# EAGLE design bbb_arduino (EAGLE 6.4)
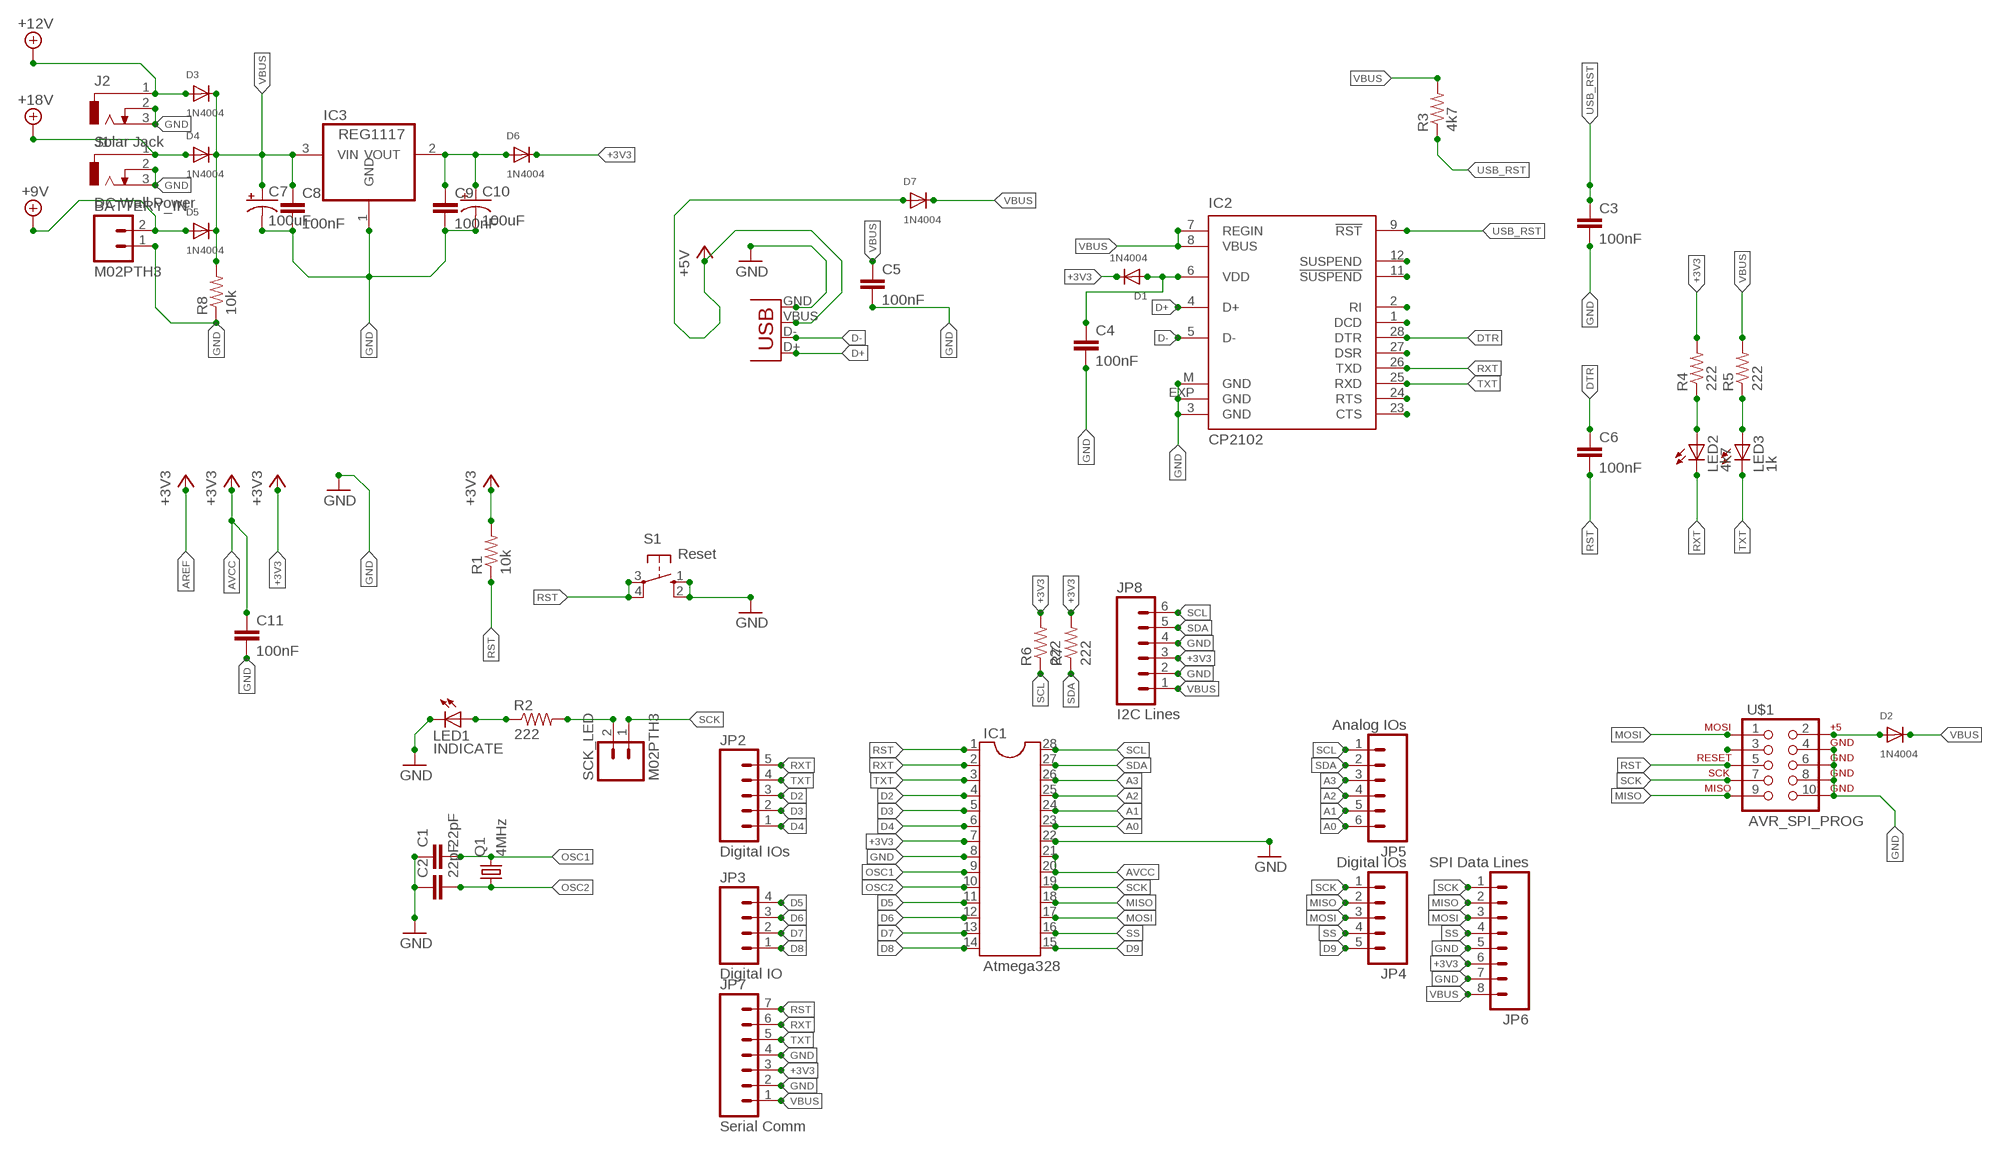
[diagram p0: schematic, sheet 1]

## Parts
BATTERY_IN  M02PTH3  [1X02_LONGPADS]
C1  22pF  CAP1206  [1206]
C2  22pF  CAP1206  [1206]
C3  100nF  CAP1206  [1206]
C4  100nF  CAP1206  [1206]
C5  100nF  CAP1206  [1206]
C6  100nF  CAP1206  [1206]
C7  100uF  CAP_POLPTH1  [CPOL-RADIAL-100UF-25V]
C8  100nF  CAP1206  [1206]
C9  100nF  CAP1206  [1206]
C10  100uF  CAP_POLPTH1  [CPOL-RADIAL-100UF-25V]
C11  100nF  CAP1206  [1206]
D1  1N4004  DIODESMA  [SMADIODE]
D2  1N4004  DIODESMA  [SMADIODE]
D3  1N4004  DIODESMA  [SMADIODE]
D4  1N4004  DIODESMA  [SMADIODE]
D5  1N4004  DIODESMA  [SMADIODE]
D6  1N4004  DIODESMA  [SMADIODE]
D7  1N4004  DIODESMA  [SMADIODE]
IC1  Atmega328  DIL28-3  [DIL28-3]
IC2  CP2102  [MLP28]
IC3  REG1117  [SOT223]
J1  DC Wall Power  DCJ0303  [DCJ0303]
J2  Solar Jack  DCJ0303  [DCJ0303]
JP1  USB-SMD-NS  [USB-MINIB-NOSTOP]
JP2  Digital IOs  M05PTH_LONGPADS  [1X05_LONGPADS]
JP3  Digital IO  M04LONGPADS  [1X04_LONGPADS]
JP4  Digital IOs  M05PTH_LONGPADS  [1X05_LONGPADS]
JP5  Analog IOs  M06LONGPADS  [1X06_LONGPADS]
JP6  SPI Data Lines  M08LONGPADS  [1X08_LONGPADS]
JP7  Serial Comm  M07LONGPADS  [1X07_LONGPADS]
JP8  I2C Lines  M06LONGPADS  [1X06_LONGPADS]
LED1  INDICATE  LEDCHIPLED_1206  [CHIPLED_1206]
LED2  4k7  LEDCHIPLED_1206  [CHIPLED_1206]
LED3  1k  LEDCHIPLED_1206  [CHIPLED_1206]
Q1  4MHz  CRYSTALHC49S  [HC49/S]
R1  10k  RESISTOR1206  [1206]
R2  222  RESISTOR1206  [1206]
R3  4k7  RESISTOR1206  [1206]
R4  222  RESISTOR1206  [1206]
R5  222  RESISTOR1206  [1206]
R6  222  RESISTOR1206  [1206]
R7  222  RESISTOR1206  [1206]
R8  10k  RESISTOR1206  [1206]
S1  Reset  10-XX  [B3F-10XX]
SCK_LED  M02PTH3  [1X02_LONGPADS]
U$1  AVR_SPI_PROG  [AVR_ICSP]

## Nets
+3V3: D1.C D6.C IC1.7 JP6.6 JP7.3 JP8.3 R1.2 R4.2 R6.2 R7.2
+5V: D7.A JP1.VBUS
+9V: BATTERY_IN.2 D5.A
+12V: D3.A J2.1
+18V: D4.A J1.1
A0: IC1.23 JP5.6
A1: IC1.24 JP5.5
A2: IC1.25 JP5.4
A3: IC1.26 JP5.3
AVCC: C11.1 IC1.20 IC1.21 ; supply symbol labelled +3V3
D2: IC1.4 JP2.3
D3: IC1.5 JP2.2
D4: IC1.6 JP2.1
D5: IC1.11 JP3.4
D6: IC1.12 JP3.3
D7: IC1.13 JP3.2
D8: IC1.14 JP3.1
D9: IC1.15 JP4.5
D+: IC2.4(D+) JP1.D+
D-: IC2.5(D-) JP1.D-
DTR: C6.1 IC2.28(DTR)
GND: BATTERY_IN.1 C1.1 C2.1 C3.2 C4.2 C5.2 C7.2(-) C8.2 C9.2 C10.2(-) C11.2 IC1.8 IC1.22 IC2.3(GND) IC2.EXP(GND) IC2.M(GND) IC3.1(GND) J1.2 J1.3 J2.2 J2.3 JP1.GND JP6.5 JP6.7 JP7.2 JP7.4 JP8.2 JP8.4 LED1.C R8.1 S1.1(S) S1.2(S1) U$1.4 U$1.6 U$1.8 U$1.10
MISO: IC1.18 JP4.2 JP6.2 U$1.9
MOSI: IC1.17 JP4.3 JP6.3 U$1.1
N$2: LED1.A R2.1
N$3: U$1.3
N$4: R2.2 SCK_LED.2
N$5: LED2.A R4.1
N$6: C4.1 D1.A IC2.6(VDD)
N$7: LED3.A R5.1
N$15: D2.A U$1.2
N$16: IC2.12(SUSPEND)
N$17: IC2.11(!SUSPEND)
N$18: IC2.2(RI)
N$19: IC2.1(DCD)
N$21: IC2.27(DSR)
N$24: IC2.24(RTS)
N$25: IC2.23(CTS)
N$33: C9.1 C10.1(+) D6.A IC3.2(VOUT)
OSC1: C1.2 IC1.9 Q1.2
OSC2: C2.2 IC1.10 Q1.1
RST: C6.2 IC1.1 JP7.7 R1.1 S1.3(P) S1.4(P1) U$1.5
RXT: IC1.2 IC2.26(TXD) JP2.5 JP7.6 LED2.C
SCK: IC1.19 JP4.1 JP6.1 SCK_LED.1 U$1.7
SCL: IC1.28 JP5.1 JP8.6 R6.1
SDA: IC1.27 JP5.2 JP8.5 R7.1
SS: IC1.16 JP4.4 JP6.4
TXT: IC1.3 IC2.25(RXD) JP2.4 JP7.5 LED3.C
USB_RST: C3.1 IC2.9(!RST) R3.1
VBUS: C5.1 C7.1(+) C8.1 D2.C D3.C D4.C D5.C D7.C IC2.7(REGIN) IC2.8(VBUS) IC3.3(VIN) JP6.8 JP7.1 JP8.1 R3.2 R5.2 R8.2

## Library data of the parts
BATTERY_IN SCK_LED = SparkFun-Connectors:M02: Standard 2-pin 0.1" header. Use with - straight break away headers ( PRT-00116) - right angle break away headers (PRT-00553) - swiss pins (PRT-00743) - machine pins (PRT-00117) - female headers (PRT-00115) Molex polarized connector foot print use with: PRT-08233 with associated crimp pins and housings. 2.54_SCREWTERM for use with PRT-10571. 3.5mm Screw Terminal footprints for PRT-08084 5mm Screw Terminal footprints for use with PRT-08433
C1-C6 C8 C9 C11 = SparkFun-Capacitors:CAP: Capacitor Standard 0603 ceramic capacitor, and 0.1" leaded capacitor.
C7 C10 = SparkFun-Capacitors:CAP_POL: Capacitor Polarized These are standard SMD and PTH capacitors. Normally 10uF, 47uF, and 100uF in electrolytic and tantalum varieties. Always verify the external diameter of the through hole cap, it varies with capacity, voltage, and manufacturer. The EIA devices should be standard.
D1-D7 = adafruit:DIODE: Diode SMADIODE - SMA Surface Mount Package 20V 1A Schottky Diode Digikey: 641-1014-6-ND DO-1N4148 - Through Hole Small Current Diode SOD-123 20V 1 A (.5mV Vf) Schottky Diode - Digikey: MBRX120TPMSCT-ND SOD-323 10V 570mA (.38mV Vf, 3ns) Schottky Diode - Digikey: ZLLS410CT-ND SOD-523 30V 30mA Schottky Diode (RB751S-40TE61) - Digikey: RB751S-40TE61CT-ND SOT23-R/W - SOT23 Package (R = Solder Paste/Reflow Ovens, W = Hand-Soldering) BAT54Film 40V 300mA - Digikey: 497-7162-1-ND
IC1 = ic-package:DIL28: Dual In Line
IC2 = silabs:CP210*: Single-Chip USB to UART Bridge Source: www.silabs.com .. CP2101.pdf / cp2102.pdf; MF: FARNELL; MPN: CP2102-GM; OC_FARNELL: 9282130; OC_NEWARK: 30K5635
IC3 = burr-brown:REG1117: 800mA and 1A Low Dropout (LDO) Positive Regulator 1.8V, 2.5V, 2.85V, 3.3V, 5V, and Adj; MPN: REG1117; OC_FARNELL: 1097566; OC_NEWARK: 14P6981
J1 J2 = con-jack:DCJ0303: DC POWER JACK Source: DCJ0303.pdf; OC_FARNELL: unknown; OC_NEWARK: unknown
JP1 = SparkFun-Connectors:USB: USB Connectors USB-B-PTH is fully proven SKU : PRT-00139/CONN-08278 USB-miniB is fully proven SKU : PRT-00587 USB-A-PCB is untested. USB-A-H is throughly reviewed, but untested. Spark Fun Electronics SKU : PRT-00437 USB-B-SMT is throughly reviewed, but untested. Needs silkscreen touching up. USB-A-S has not been used/tested USB-MB-H has not been used/tested USB-MICROB has been used. CONN-09505
JP2 JP4 = SparkFun-Connectors:M05: Header 5 Standard 5-pin 0.1" header. Use with straight break away headers (SKU : PRT-00116), right angle break away headers (PRT-00553), swiss pins (PRT-00743), machine pins (PRT-00117), and female headers (PRT-00115). Molex polarized connector foot print use with SKU : PRT-08230 with associated crimp pins and housings.
JP3 = SparkFun-Connectors:M04: Header 4 Standard 4-pin 0.1" header. Use with straight break away headers (SKU : PRT-00116), right angle break away headers (PRT-00553), swiss pins (PRT-00743), machine pins (PRT-00117), and female headers (PRT-00115). Molex polarized connector foot print use with SKU : PRT-08231 with associated crimp pins and housings. 1MM SMD Version SKU: PRT-10208
JP5 JP8 = SparkFun-Connectors:M06: Header 6 Standard 6-pin 0.1" header. Use with straight break away headers (SKU : PRT-00116), right angle break away headers (PRT-00553), swiss pins (PRT-00743), machine pins (PRT-00117), and female headers (PRT-00115). Molex polarized connector foot print use with SKU : PRT-08094 with associated crimp pins and housings. NOTES ON THE VARIANTS LOCK and LOCK_LONGPADS... This footprint was designed to help hold the alignment of a through-hole component (i.e. 6-pin header) while soldering it into place. You may notice that each hole has been shifted either up or down by 0.005 of an inch from it's more standard position (which is a perfectly straight line). This slight alteration caused the pins (the squares in the middle) to touch the edges of the holes. Because they are alternating, it causes a "brace" to hold the component in place. 0.005 has proven to be the perfect amount of "off-center" position when using our standard breakaway headers. Although looks a little odd when you look at the bare footprint, once you have a header in there, the alteration is very hard to notice. Also,if you push a header all the way into place, it is covered up entirely on the bottom side. This idea of altering the position of holes to aid alignment will be further integrated into the Sparkfun Library for other footprints. It can help hold any component with 3 or more connection pins.
JP6 = SparkFun-Connectors:M08: Header 8 Standard 8-pin 0.1" header. Use with straight break away headers (SKU : PRT-00116), right angle break away headers (PRT-00553), swiss pins (PRT-00743), machine pins (PRT-00117), and female headers (PRT-00115).
JP7 = SparkFun-Connectors:M07: Header 7 Standard 7-pin 0.1" header. Use with straight break away headers (SKU : PRT-00116), right angle break away headers (PRT-00553), swiss pins (PRT-00743), machine pins (PRT-00117), and female headers (PRT-00115). NOTES ON THE VARIANTS LOCK and LOCK_LONGPADS... This footprint was designed to help hold the alignment of a through-hole component (i.e. 7-pin header) while soldering it into place. You may notice that each hole has been shifted either up or down by 0.005 of an inch from it's more standard position (which is usually a perfectly straight line). This slight alteration caused the pins (the squares in the middle) to touch the edges of the holes. Because they are alternating, it causes a "brace" to hold the header in place. 0.005 has proven to be the perfect amount of "off-center" position when using our standard breakaway headers. Although looks a little odd when you look at the bare footprint, once you have a header in there, the alteration is very hard to notice. Also, if you push a header all the way into place, it is covered up entirely on the bottom side. This idea of altering the position of holes to aid alignment will be further integrated into the Sparkfun Library for other footprints. It can help hold any component with 3 or more connection pins.
LED1-LED3 = adafruit:LED: LED OSRAM: - CHIPLED LG R971, LG N971, LY N971, LG Q971, LY Q971, LO R971, LY R971 LH N974, LH R974 LS Q976, LO Q976, LY Q976 LO Q996 - Hyper CHIPLED LW Q18S LB Q993, LB Q99A, LB R99A - SideLED LS A670, LO A670, LY A670, LG A670, LP A670 LB A673, LV A673, LT A673, LW A673 LH A674 LY A675 LS A676, LA A676, LO A676, LY A676, LW A676 LS A679, LY A679, LG A679 - Hyper Micro SIDELED® LS Y876, LA Y876, LO Y876, LY Y876 LT Y87S - SmartLED LW L88C, LW L88S LB L89C, LB L89S, LG L890 LS L89K, LO L89K, LY L89K LS L896, LA L896, LO L896, LY L896 - TOPLED LS T670, LO T670, LY T670, LG T670, LP T670 LSG T670, LSP T670, LSY T670, LOP T670, LYG T670 LG T671, LOG T671, LSG T671 LB T673, LV T673, LT T673, LW T673 LH T674 LS T676, LA T676, LO T676, LY T676, LB T676, LH T676, LSB T676, LW T676 LB T67C, LV T67C, LT T67C, LS T67K, LO T67K, LY T67K, LW E67C LS E67B, LA E67B, LO E67B, LY E67B, LB E67C, LV E67C, LT E67C LW T67C LS T679, LY T679, LG T679 LS T770, LO T770, LY T770, LG T770, LP T770 LB T773, LV T773, LT T773, LW T773 LH T774 LS E675, LA E675, LY E675, LS T675 LS T776, LA T776, LO T776, LY T776, LB T776 LHGB T686 LT T68C, LB T68C - Hyper Mini TOPLED® LB M676 - Mini TOPLED Santana® LG M470 LS M47K, LO M47K, LY M47K Source: http://www.osram.convergy.de/
Q1 = adafruit:CRYSTAL: CRYSTAL; OC_FARNELL: 1667008; OC_NEWARK: unknown
R1-R8 = SparkFun-Resistors:RESISTOR: Resistor Basic schematic elements and footprints for 0603, 1206, and PTH resistors.
S1 = switch-omron:10-XX: OMRON SWITCH; MPN: B3F-1000; OC_FARNELL: 176432; OC_NEWARK: 36M3542
U$1 = SparkFun-Connectors:AVR_SPI_PROG: AVR 10-pin ICSP Header This is the standard AVR In Circuit Serial Programming header. Minimal, but includes pin one indicator. Works with standard Olimex programmers. Also look for the 6-pin reduced version. Spark Fun Electronics SKU: PRT-00778

## Board
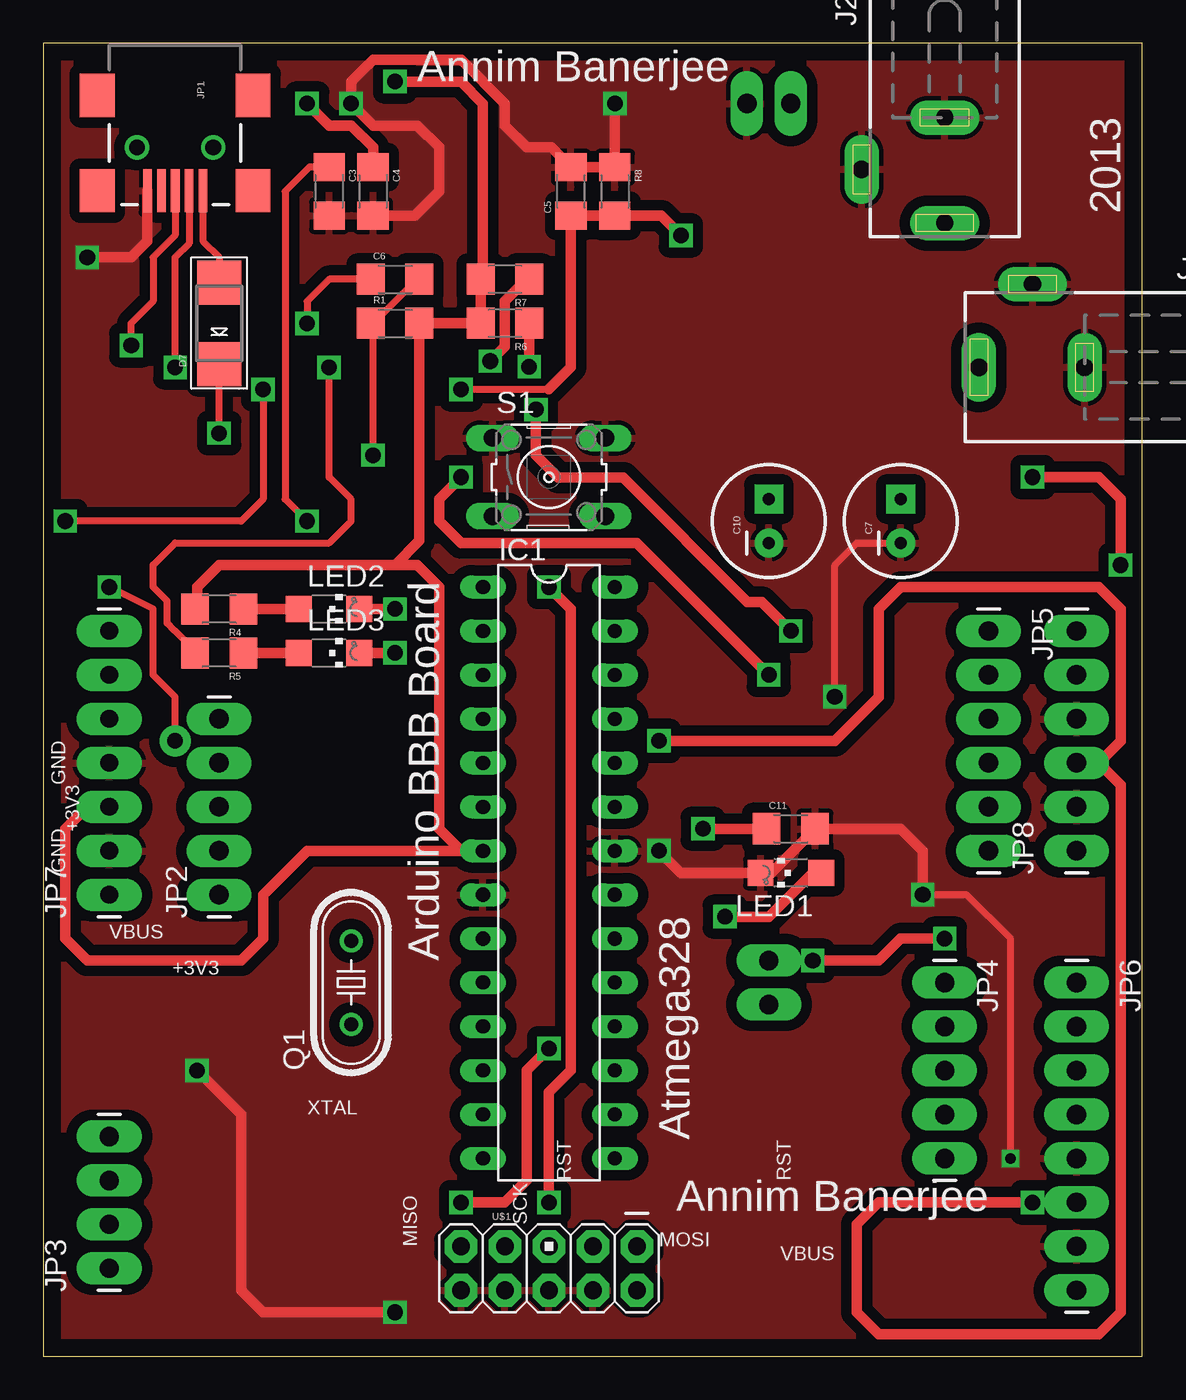
[diagram p1: board, top side]
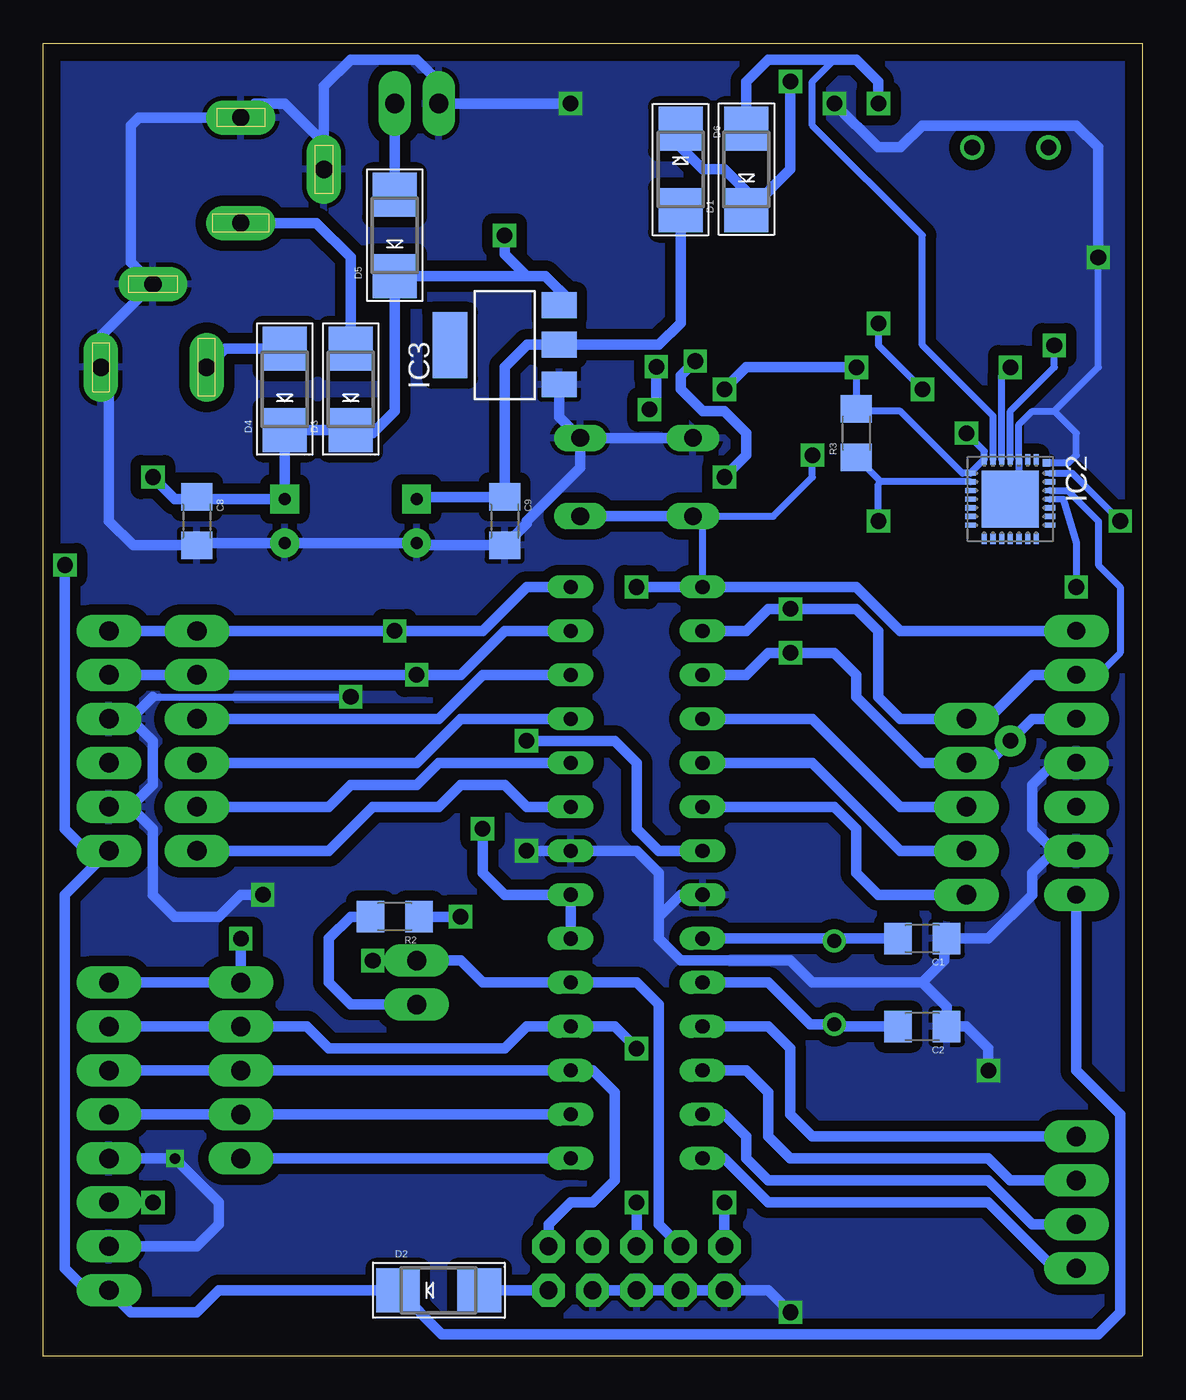
[diagram p2: board, bottom side, seen from below]

Size 63.48 x 75.87 mm. Coordinates in mm from the lower left corner, seen from the top.
Outline: 0,0 63.48,0 63.48,75.87 0,75.87 0,0
Copper layers (1*16): Top 0.035mm / dielectric 1.5mm / Bottom 0.035mm
Design rules "default": minimum track width 10mil, minimum drill 24mil, track to track 8mil, track to pad 8mil, pad to pad 8mil, via to via 8mil, smd to smd 8mil, copper to edge 40mil, drill to drill 8mil, minimum pad ring 10mil, minimum via ring 8mil, stop-mask expansion 4mil, vias tented up to drill 0mil, thermal gap 10mil

### Footprints (pad centres in the part's own frame; a part is rotated, then mirrored left to right if it is on the bottom)
1X02_LONGPADS = drill 1.118 pad 1.88 long: 1 0,0; 2 2.54,0
1206 = smd 1.6 x 1.8: 1 -1.4,0; 2 1.4,0
CPOL-RADIAL-100UF-25V = drill 0.7 pad 1.651 square: 1 1.27,0 | drill 0.7 pad 1.651: 2 -1.27,0
SMADIODE = smd 2.54 x 2.54: A 2.349,0; C -2.349,0
DIL28-3 = drill 0.813 long: 1 -16.51,-3.81; 2 -13.97,-3.81; 3 -11.43,-3.81; 4 -8.89,-3.81; 5 -6.35,-3.81; 6 -3.81,-3.81; 7 -1.27,-3.81; 8 1.27,-3.81; 9 3.81,-3.81; 10 6.35,-3.81; 11 8.89,-3.81; 12 11.43,-3.81; 13 13.97,-3.81; 14 16.51,-3.81; 15 16.51,3.81; 16 13.97,3.81; 17 11.43,3.81; 18 8.89,3.81; 19 6.35,3.81; 20 3.81,3.81; 21 1.27,3.81; 22 -1.27,3.81; 23 -3.81,3.81; 24 -6.35,3.81; 25 -8.89,3.81; 26 -11.43,3.81; 27 -13.97,3.81; 28 -16.51,3.81
MLP28 = smd 0.6 x 0.3: 1 -2.3,1.5; 2 -2.3,1; 3 -2.3,0.5; 4 -2.3,0; 5 -2.3,-0.5; 6 -2.3,-1; 7 -2.3,-1.5; 15 2.3,-1.5; 16 2.3,-1; 17 2.3,-0.5; 18 2.3,0; 19 2.3,0.5; 20 2.3,1; 21 2.3,1.5 | smd 0.3 x 0.6: 8 -1.5,-2.3; 9 -1,-2.3; 10 -0.5,-2.3; 11 0,-2.3; 12 0.5,-2.3; 13 1,-2.3; 14 1.5,-2.3; 22 1.5,2.3; 23 1,2.3; 24 0.5,2.3; 25 0,2.3; 26 -0.5,2.3; 27 -1,2.3; 28 -1.5,2.3 | smd 3.3 x 3.3: EXP 0,0 | smd 0.435 x 0.435: M -2.103,2.103
SOT223 = smd 1.499 x 2.007: 1 -2.261,-3.15; 2 0.025,-3.15; 3 2.311,-3.15 | smd 3.81 x 2.007: 4 0,3.15
DCJ0303 = drill 1 pad 2 long: 1 0,3.1; 2 4.8,0; 3 0,-3
USB-MINIB-NOSTOP = smd 2.5 x 0.5: D+ 2.5,0; D- 2.5,0.8; GND 2.5,-1.6; ID 2.5,-0.8; VBUS 2.5,1.6 | smd 2.5 x 2: G1 -3,-4.5; G2 -3,4.5; G3 2.5,4.5; G4 2.5,-4.5 | drill 0.9 pad 0.8: H1 0,2.2 | drill 0.9 pad 0.787: H2 0,-2.2
1X05_LONGPADS = drill 1.118 pad 1.88 long: 1 0,0; 2 2.54,0; 3 5.08,0; 4 7.62,0; 5 10.16,0
1X04_LONGPADS = drill 1.118 pad 1.88 long: 1 0,0; 2 2.54,0; 3 5.08,0; 4 7.62,0
1X06_LONGPADS = drill 1.118 pad 1.88 long: 1 0,0; 2 2.54,0; 3 5.08,0; 4 7.62,0; 5 10.16,0; 6 12.7,0
1X08_LONGPADS = drill 1.118 pad 1.88 long: 1 0,0; 2 2.54,0; 3 5.08,0; 4 7.62,0; 5 10.16,0; 6 12.7,0; 7 15.24,0; 8 17.78,0
1X07_LONGPADS = drill 1.016 pad 1.88 long: 1 0,0; 2 2.54,0; 3 5.08,0; 4 7.62,0; 5 10.16,0; 6 12.7,0; 7 15.24,0
CHIPLED_1206 = smd 1.5 x 1.5: A 0,-1.75; C 0,1.75
HC49/S = drill 0.813: 1 -2.413,0; 2 2.413,0
B3F-10XX = drill 1.016 long: 1 -3.251,2.261; 2 3.251,2.261; 3 -3.251,-2.261; 4 3.251,-2.261
AVR_ICSP = drill 1.016 pad 1.88 octagon: 1 -1.27,5.08; 2 1.27,5.08; 3 -1.27,2.54; 4 1.27,2.54; 5 -1.27,0; 6 1.27,0; 7 -1.27,-2.54; 8 1.27,-2.54; 9 -1.27,-5.08; 10 1.27,-5.08

### Placement (x,y rotation side)
BATTERY_IN  40.64,72.39 0 top
C1  12.7,24.13 180 bottom
C2  12.7,19.05 180 bottom
C3  16.51,67.31 270 top
C4  19.05,67.31 270 top
C5  30.48,67.31 90 top
C6  20.32,62.23 0 top
C7  49.53,48.26 90 top
C8  54.61,48.26 270 bottom
C9  36.83,48.26 270 bottom
C10  41.91,48.26 90 top
C11  43.18,30.48 0 top
D1  22.86,68.58 90 bottom
D2  40.64,3.81 0 bottom
D3  45.72,55.88 90 bottom
D4  49.53,55.88 90 bottom
D5  43.18,64.77 90 bottom
D6  26.67,68.58 270 bottom
D7  10.16,59.69 90 top
IC1  29.21,27.94 270 top
IC2  7.62,49.53 270 bottom
IC3  36.83,58.42 90 bottom
J1  57.15,57.15 90 top
J2  52.07,68.58 180 top
JP1  7.62,69.85 270 top
JP2  10.16,26.67 90 top
JP3  3.81,5.08 90 top
JP4  52.07,21.59 270 top
JP5  54.61,41.91 270 top
JP6  59.69,21.59 270 top
JP7  3.81,26.67 90 top
JP8  59.69,29.21 90 top
LED1  43.18,27.94 90 top
LED2  16.51,43.18 270 top
LED3  16.51,40.64 270 top
Q1  17.78,21.59 90 top
R1  20.32,59.69 0 top
R2  43.18,25.4 180 bottom
R3  16.51,53.34 90 bottom
R4  10.16,43.18 180 top
R5  10.16,40.64 180 top
R6  26.67,59.69 180 top
R7  26.67,62.23 180 top
R8  33.02,67.31 270 top
S1  29.21,50.8 0 top
SCK_LED  41.91,22.86 270 top
U$1  29.21,5.08 270 top

### Tracks (layer width: path | path; a pad name or v marks a point on that pad's centre or on a via)
+3V3  (via drill 0.9)
  Top 0.61: v20.32,73.66 24.13,73.66 25.4,72.39 25.4,62.36 R7.2 R6.2 R1.2 21.72,47.12 20.32,45.72 | 20.32,45.72 10.16,45.72 8.89,44.45 8.89,43.31 R4.2 | v57.15,8.89 48.26,8.89 46.99,7.62 46.99,2.54 48.26,1.27 60.96,1.27 62.23,2.54 62.23,33.02 60.96,34.29 | JP8.3 60.96,34.29 | 60.96,34.29 62.23,35.56 62.23,43.18 60.96,44.45 49.53,44.45 48.26,43.18 48.26,38.1 45.72,35.56 v35.56,35.56 | 20.32,45.72 21.59,45.72 22.86,44.45 22.86,30.48 24.13,29.21 IC1.7 15.24,29.21 12.7,26.67 12.7,24.13 11.43,22.86 2.54,22.86 1.27,24.13 1.27,30.48 2.54,31.75 JP7.3
  Bottom 0.61: D6.C 26.67,69.85 25.4,68.58 24.13,68.58 22.86,67.31 D1.C 22.67,66.23 20.32,68.58 v20.32,73.66 | JP6.6 v57.15,8.89 | v35.56,35.56 30.48,35.56 29.21,34.29 29.21,30.48 27.94,29.21 IC1.7
+5V
  Top 0.406: JP1.VBUS 9.22,64.44 10.16,63.5 D7.A
+9V
  Bottom 0.61: BATTERY_IN.2 D5.A
+12V
  Bottom 0.61: J2.1 47.7,65.48 45.72,63.5 D3.A
+18V
  Bottom 0.61: D4.A 52.97,58.23 J1.1
A0
  Bottom 0.61: JP5.6 46.99,29.21 44.45,31.75 40.64,31.75 39.37,33.02 36.83,33.02 35.56,31.75 IC1.23
A1
  Bottom 0.61: IC1.24 40.64,34.29 41.91,33.02 45.72,33.02 46.99,31.75 JP5.5
A2
  Bottom 0.61: IC1.25 39.37,36.83 41.91,34.29 JP5.4
A3
  Bottom 0.61: IC1.26 38.1,39.37 40.64,36.83 JP5.3
AVCC  (via drill 0.9)
  Top 0.61: v38.1,30.48 C11.1
  Bottom 0.61: IC1.20 IC1.21 36.83,26.67 38.1,27.94 v38.1,30.48
D2
  Bottom 0.61: IC1.4 19.05,36.83 13.97,31.75 JP2.3
D3
  Bottom 0.61: IC1.5 19.05,34.29 13.97,29.21 JP2.2
D4
  Bottom 0.61: IC1.6 17.78,31.75 16.51,30.48 16.51,27.94 15.24,26.67 JP2.1
D5
  Bottom 0.61: IC1.11 21.59,19.05 20.32,17.78 20.32,13.97 19.05,12.7 JP3.4
D6
  Bottom 0.61: IC1.12 22.86,16.51 21.59,15.24 21.59,12.7 20.32,11.43 8.89,11.43 7.62,10.16 JP3.3
D7
  Bottom 0.61: IC1.13 24.13,13.97 22.86,12.7 22.86,11.43 21.59,10.16 8.89,10.16 6.35,7.62 JP3.2
D8
  Bottom 0.61: IC1.14 24.13,11.43 21.59,8.89 8.89,8.89 5.08,5.08 JP3.1
D9
  Bottom 0.61: IC1.15 JP4.5
D+  (via drill 0.9)
  Top 0.406: v5.08,58.42 5.08,59.69 6.35,60.96 6.35,63.5 7.62,64.77 JP1.D+
  Bottom 0.406: IC2.4 7.62,54.61 5.08,57.15 v5.08,58.42
D-  (via drill 0.9)
  Top 0.406: v7.62,57.15 7.62,63.5 8.42,64.3 JP1.D-
  Bottom 0.406: IC2.5 8.12,56.65 v7.62,57.15
DTR  (via drill 0.9)
  Top 0.406: C6.1 16.51,62.23 15.24,60.96 v15.24,59.69 | v12.7,55.88 12.7,49.53 11.43,48.26 v1.27,48.26
  Bottom 0.406: v15.24,59.69 15.24,58.42 v12.7,55.88 | v1.27,48.26 4.04,51.03 IC2.28
GND  (via drill 0.6, 0.9)
  Top 0.406: v45.72,38.1 45.72,45.72 46.99,46.99 C7.2 | v55.88,11.43 55.88,24.13 53.34,26.67 v50.8,26.67
  Top 0.61: v35.56,29.21 36.83,27.94 LED1.C 42.04,27.94 C11.2 49.53,30.48 50.8,29.21 v50.8,26.67 | v20.32,2.54 12.7,2.54 11.43,3.81 11.43,13.97 v8.89,16.51 | C4.2 21.46,65.91 22.86,67.31 22.86,69.85 21.59,71.12 19.05,71.12 v17.78,72.39 17.78,73.66 19.05,74.93 24.13,74.93 26.67,72.39 26.67,71.12 27.94,69.85 29.34,69.85 C5.2 R8.1 v33.02,72.39 | JP1.GND 6.02,64.44 5.08,63.5 v2.54,63.5
  Bottom 0.406: IC2.M 4.25,51.63 3.81,52.07 3.81,53.34 5.08,54.61 | IC2.EXP 7.12,50.03 IC2.3 7.12,53.84 6.35,54.61 5.08,54.61 | 5.08,54.61 2.54,57.15 v2.54,63.5 | 57.15,38.1 v45.72,38.1
  Bottom 0.61: v35.56,29.21 IC1.22 29.21,29.21 27.94,27.94 27.94,25.4 | v8.89,16.51 8.89,17.78 10.16,19.05 C2.1 11.3,20.19 12.7,21.59 | U$1.4 U$1.6 U$1.8 U$1.10 21.59,3.81 v20.32,2.54 | IC1.8 26.67,26.67 27.94,25.4 | 27.94,25.4 27.94,24.13 26.67,22.86 20.32,22.86 19.05,21.59 12.7,21.59 | 12.7,21.59 11.43,22.86 11.43,24 C1.1 8.89,24.13 6.35,26.67 6.35,27.94 5.08,29.21 | JP7.4 5.08,34.29 6.35,33.02 6.35,30.48 5.08,29.21 | 5.08,29.21 JP7.2 | JP8.4 58.42,36.83 | 58.42,36.83 57.15,35.56 57.15,33.02 58.42,31.75 | JP8.2 58.42,31.75 | 58.42,31.75 57.15,30.48 57.15,26.67 55.88,25.4 53.34,25.4 52.07,26.67 v50.8,26.67 | v33.02,72.39 BATTERY_IN.1 40.64,73.66 41.91,74.93 45.72,74.93 47.27,73.38 J2.2 47.27,70.13 49.53,72.39 51.26,72.39 J2.3 57.96,71.58 58.42,71.12 58.42,63.22 J1.2 60.15,58.95 J1.3 59.69,56.69 59.69,48.26 58.29,46.86 C8.2 54.48,46.99 C7.2 C10.2 41.78,46.86 C9.2 35.56,48.13 35.56,48.26 32.46,51.36 S1.2 | v2.54,63.5 2.54,69.85 3.81,71.12 12.7,71.12 13.97,69.85 15.24,69.85 v17.78,72.39 | S1.1 S1.2 | IC3.1 33.68,54.28 S1.2 | JP6.7 54.61,6.35 53.34,7.62 53.34,8.89 v55.88,11.43 JP6.5 | 58.42,36.83 57.15,38.1
  pour Top (isolate 0.61): 0,76.2 63.5,76.2 63.5,0 0,0
  pour Bottom (isolate 0.61): 0,76.2 63.5,76.2 63.5,0 0,0
MISO  (via drill 0.9)
  Top 0.61: v29.21,17.78 27.94,16.51 27.94,10.16 26.67,8.89 v24.13,8.89
  Bottom 0.61: JP6.2 JP4.2 48.26,19.05 46.99,17.78 36.83,17.78 35.56,19.05 IC1.18 30.48,19.05 v29.21,17.78 | v24.13,8.89 U$1.9
MOSI
  Bottom 0.61: JP6.3 JP4.3 IC1.17 31.75,16.51 30.48,15.24 30.48,10.16 31.75,8.89 33.02,8.89 34.29,7.62 U$1.1
N$2  (via drill 0.9)
  Top 0.61: LED1.A 44.45,27.94 41.91,25.4 v39.37,25.4
  Bottom 0.61: v39.37,25.4 R2.1
N$4
  Bottom 0.61: SCK_LED.2 45.72,20.32 46.99,21.59 46.99,24.13 45.72,25.4 R2.2
N$5
  Top 0.61: R4.1 LED2.A
N$6  (via drill 0.9)
  Top 0.61: v15.24,72.39 16.51,71.12 17.78,71.12 19.05,69.85 C4.1
  Bottom 0.406: IC2.6 8.62,54.34 12.7,58.42 12.7,64.77 19.05,71.12 19.05,73.66 17.78,74.93
  Bottom 0.61: D1.A 22.86,73.66 21.59,74.93 17.78,74.93 16.51,74.93 15.24,73.66 v15.24,72.39
N$7
  Top 0.61: R5.1 LED3.A
N$15
  Bottom 0.61: U$1.2 D2.A
N$33
  Bottom 0.61: C10.1 41.78,49.66 C9.1 36.83,57.15 35.53,58.45 IC3.2 27.91,58.45 26.67,59.69 D6.A
OSC1
  Bottom 0.61: IC1.9 17.91,24.13 Q1.2 17.65,24.13 C1.2
OSC2
  Bottom 0.61: IC1.10 21.59,21.59 19.18,19.18 Q1.1 17.65,19.05 C2.2
RST  (via drill 0.9)
  Top 0.406: v19.05,52.07 19.05,59.56 R1.1 19.05,59.69 21.59,62.23 C6.2
  Top 0.61: v29.21,44.45 30.48,43.18 30.48,16.51 29.21,15.24 v29.21,8.89
  Bottom 0.406: IC1.1 25.4,47.98 S1.3 21.31,48.54 19.05,50.8 v19.05,52.07
  Bottom 0.61: JP7.7 13.97,41.91 16.51,44.45 IC1.1 v29.21,44.45 | U$1.5 v29.21,8.89 | S1.4 S1.3
RXT  (via drill 0.9)
  Top 0.61: LED2.C v20.32,43.18
  Bottom 0.406: IC2.26 4.31,50.03 2.54,48.26 2.54,45.72 1.27,44.45 1.27,40.64 2.54,39.37 JP7.6
  Bottom 0.61: IC1.2 22.86,41.91 21.59,43.18 v20.32,43.18 16.51,43.18 15.24,41.91 15.24,38.1 13.97,36.83 JP2.5 8.89,36.83 6.35,39.37 JP7.6
SCK  (via drill 0.9)
  Top 0.61: v44.45,22.86 48.26,22.86 49.53,24.13 v52.07,24.13
  Bottom 0.61: JP6.1 JP4.1 v52.07,24.13 | U$1.7 27.94,7.62 27.94,20.32 29.21,21.59 IC1.19 38.1,21.59 39.37,22.86 SCK_LED.1 v44.45,22.86
SCL  (via drill 0.9)
  Top 0.61: R6.1 28.07,57.52 v28.07,57.18 | v28.46,54.7 28.46,52.06 29.75,50.76 33.5,50.76 40.66,43.59 41.5,43.59 v43.18,41.91
  Bottom 0.61: JP8.6 JP5.1 v43.18,41.91 38.1,41.91 35.56,44.45 IC1.28 | v28.07,57.18 28.08,55.08 v28.46,54.7
SDA  (via drill 0.9)
  Top 0.61: R7.1 27.94,62.23 26.67,60.96 26.67,58.35 v25.82,57.5 | v24.13,50.8 22.86,49.53 22.86,48.26 24.13,46.99 34.29,46.99 v41.91,39.37
  Bottom 0.61: JP8.5 JP5.2 v41.91,39.37 39.37,39.37 36.83,41.91 IC1.27 | v24.13,50.8 22.86,52.07 22.86,53.34 24.13,54.61 25.4,54.61 26.67,55.88 26.67,56.65 v25.82,57.5
SS
  Bottom 0.61: IC1.16 JP4.4 JP6.4
TXT  (via drill 0.9, 0.9 pad 1.78)
  Top 0.406: v7.62,35.56 7.62,38.1 6.35,39.37 6.35,43.18 v3.81,44.45
  Top 0.61: LED3.C v20.32,40.64
  Bottom 0.406: IC2.25 4.55,49.51 3.81,46.99 v3.81,44.45
  Bottom 0.61: IC1.3 22.86,39.37 21.59,40.64 v20.32,40.64 17.78,40.64 16.51,39.37 16.51,38.1 12.7,34.29 JP2.4 8.89,34.29 v7.62,35.56 6.35,36.83 JP7.5
USB_RST  (via drill 0.9)
  Top 0.406: C3.1 15.37,68.71 13.97,67.31 13.97,49.53 v15.24,48.26
  Bottom 0.406: IC2.9 15.1,50.53 | 15.1,50.53 R3.1 | v15.24,48.26 15.24,50.39 15.1,50.53
VBUS  (via drill 0.9)
  Top 0.406: v10.16,53.34 D7.C | R5.2 8.76,40.77 7.62,41.91 7.6,41.91 7.16,42.35 7.16,43.64 6.35,44.45 6.35,45.72 7.62,46.99 16.51,46.99 17.78,48.26 17.78,49.53 16.51,50.8 v16.51,57.15 | v24.13,55.88 29.21,55.88
  Top 0.61: 29.21,55.88 30.48,57.15 C5.1 R8.2 35.69,65.91 v36.83,64.77 | v57.15,50.8 60.96,50.8 62.23,49.53 v62.23,45.72
  Bottom 0.406: v10.16,53.34 9.12,52.3 IC2.7 IC2.8 10.39,51.03 13.97,54.61 16.38,54.61 R3.2 v16.51,57.15
  Bottom 0.61: 54.48,49.53 C7.1 D4.C D3.C 45.53,53.34 44.45,53.34 43.18,54.61 D5.C 35.56,62.42 | 54.48,49.53 C8.1 | 35.56,62.42 34.48,62.42 33.02,60.96 33.45,60.96 IC3.3 | v36.83,64.77 36.83,63.69 35.56,62.42 | v16.51,57.15 22.86,57.15 v24.13,55.88 | 54.48,49.53 55.88,49.53 v57.15,50.8 | v62.23,45.72 62.23,30.48 60.96,29.21 JP8.1 62.23,26.67 62.23,5.08 60.96,3.81 JP6.8 58.42,2.54 54.61,2.54 53.34,3.81 D2.C 40.45,1.27 2.54,1.27 1.27,2.54 1.27,13.97 3.81,16.51 JP7.1

### Text on the board
tPlace: +3V3 | GND | GND | Atmega328 | VBUS | +3V3 | Arduino BBB Board | XTAL | RST | RST | Annim Banerjee | SCK | MISO | MOSI | VBUS
tSilk: Annim Banerjee | 2013